# EAGLE schematic WAK-Shield-v11 (EAGLE 6.2)
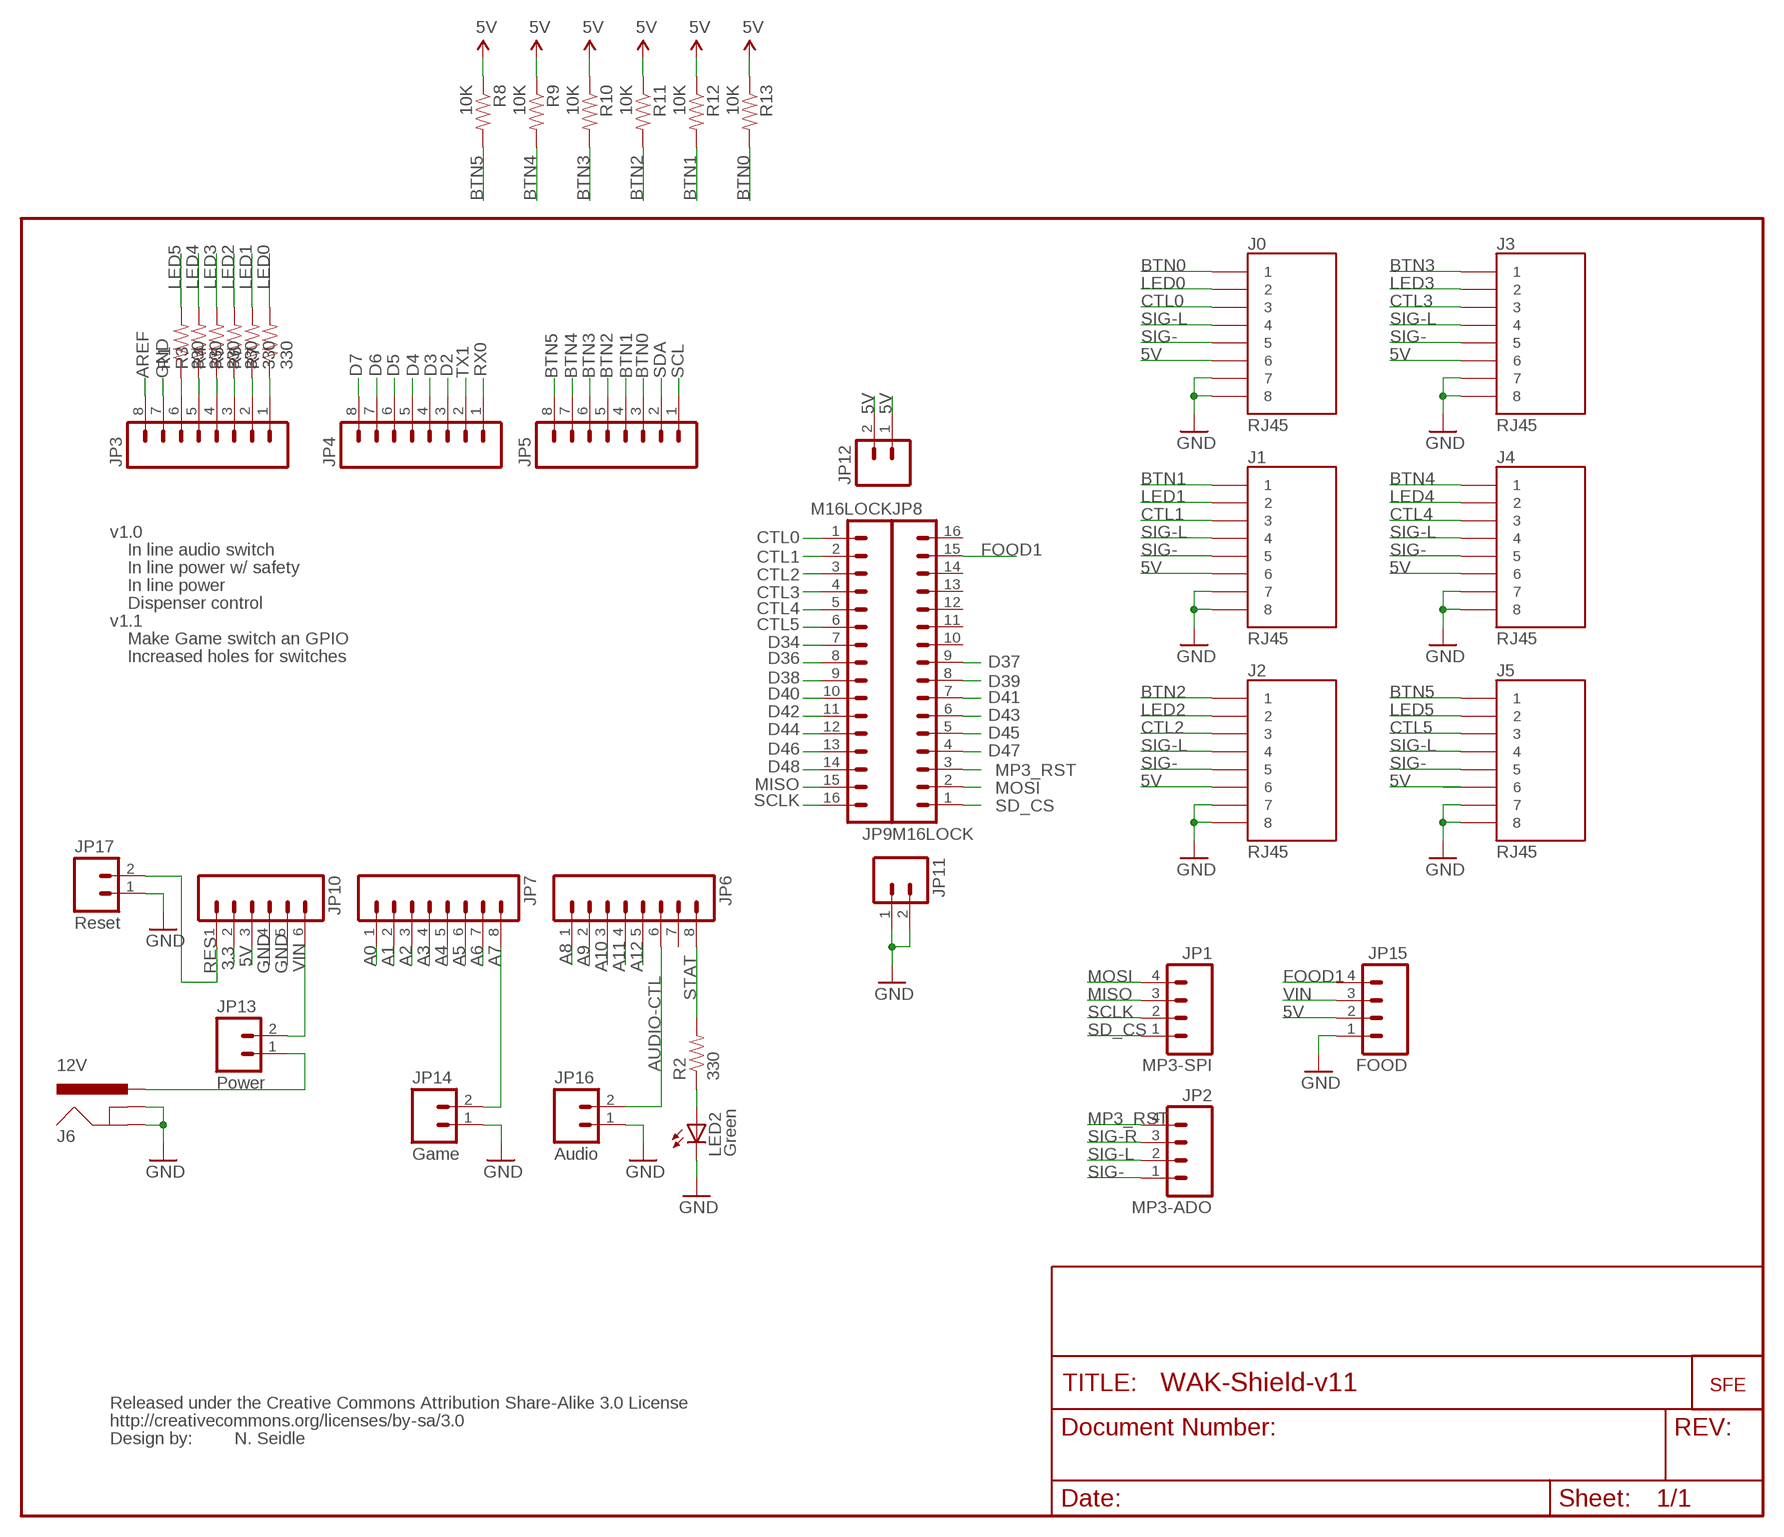
[diagram p0: schematic, sheet 1]

## Parts
J0  RJ45  RJ45-8PTH  [RJ45-8]
J1  RJ45  RJ45-8PTH  [RJ45-8]
J2  RJ45  RJ45-8PTH  [RJ45-8]
J3  RJ45  RJ45-8PTH  [RJ45-8]
J4  RJ45  RJ45-8PTH  [RJ45-8]
J5  RJ45  RJ45-8PTH  [RJ45-8]
J6  12V  POWER_JACKPTH_LOCK  [POWER_JACK_PTH_LOCK]
JP1  MP3-SPI  M04JST-PTH  [JST-4-PTH]
JP2  MP3-ADO  M04JST-PTH  [JST-4-PTH]
JP3  M08LOCK  [1X08_LOCK]
JP4  M08LOCK  [1X08_LOCK]
JP5  M08LOCK  [1X08_LOCK]
JP6  M08LOCK  [1X08_LOCK]
JP7  M08LOCK  [1X08_LOCK]
JP8  M16LOCK  [1X16_LOCK]
JP9  M16LOCK  [1X16_LOCK]
JP10  M06LOCK  [1X06_LOCK]
JP11  M02LOCK  [1X02_LOCK]
JP12  M02LOCK  [1X02_LOCK]
JP13  Power  M02PTH  [1X02]
JP14  Game  M02PTH  [1X02]
JP15  FOOD  M04JST-PTH  [JST-4-PTH]
JP16  Audio  M02PTH  [1X02]
JP17  Reset  M023.5MM  [SCREWTERMINAL-3.5MM-2]
LED2  Green  LED5MM  [LED5MM]
R1  330  RESISTORPTH1  [AXIAL-0.3]
R2  330  RESISTORPTH1  [AXIAL-0.3]
R3  330  RESISTORPTH1  [AXIAL-0.3]
R4  330  RESISTORPTH1  [AXIAL-0.3]
R5  330  RESISTORPTH1  [AXIAL-0.3]
R6  330  RESISTORPTH1  [AXIAL-0.3]
R7  330  RESISTORPTH1  [AXIAL-0.3]
R8  10K  RESISTORPTH1  [AXIAL-0.3]
R9  10K  RESISTORPTH1  [AXIAL-0.3]
R10  10K  RESISTORPTH1  [AXIAL-0.3]
R11  10K  RESISTORPTH1  [AXIAL-0.3]
R12  10K  RESISTORPTH1  [AXIAL-0.3]
R13  10K  RESISTORPTH1  [AXIAL-0.3]
U$1  LOGO-SFENEW  [SFE-NEW-WEBLOGO]
U$2  CREATIVE_COMMONS  [CREATIVE_COMMONS]

## Nets
3.3: JP10.2
5V: J0.6 J1.6 J2.6 J3.6 J4.6 J5.6 JP10.3 JP12.1 JP12.2 JP15.2 R8.P$1 R9.P$1 R10.P$1 R11.P$1 R12.P$1 R13.P$1
A0: JP7.1
A1: JP7.2
A2: JP7.3
A3: JP7.4
A4: JP7.5
A5: JP7.6
A6: JP7.7
A7: JP7.8 JP14.2
A8: JP6.1
A9: JP6.2
A10: JP6.3
A11: JP6.4
A12: JP6.5
AREF: JP3.8
AUDIO-CTL: JP6.6 JP16.2
BTN0: J0.1 JP5.3 R13.P$2
BTN1: J1.1 JP5.4 R12.P$2
BTN2: J2.1 JP5.5 R11.P$2
BTN3: J3.1 JP5.6 R10.P$2
BTN4: J4.1 JP5.7 R9.P$2
BTN5: J5.1 JP5.8 R8.P$2
CTL0: J0.3 JP9.1
CTL1: J1.3 JP9.2
CTL2: J2.3 JP9.3
CTL3: J3.3 JP9.4
CTL4: J4.3 JP9.5
CTL5: J5.3 JP9.6
D2: JP4.3
D3: JP4.4
D4: JP4.5
D5: JP4.6
D6: JP4.7
D7: JP4.8
D34: JP9.7
D36: JP9.8
D37: JP8.9
D38: JP9.9
D39: JP8.8
D40: JP9.10
D41: JP8.7
D42: JP9.11
D43: JP8.6
D44: JP9.12
D45: JP8.5
D46: JP9.13
D47: JP8.4
D48: JP9.14
FOOD1: JP8.15 JP15.4
GND: J0.7 J0.8 J1.7 J1.8 J2.7 J2.8 J3.7 J3.8 J4.7 J4.8 J5.7 J5.8 J6.GND J6.GNDBREAK JP3.7 JP10.4 JP10.5 JP11.1 JP11.2 JP14.1 JP15.1 JP16.1 JP17.1 LED2.K(C)
LED0: J0.2 R7.P$2
LED1: J1.2 R6.P$2
LED2: J2.2 R5.P$2
LED3: J3.2 R4.P$2
LED4: J4.2 R3.P$2
LED5: J5.2 R1.P$2
MISO: JP1.3 JP9.15
MOSI: JP1.4 JP8.2
MP3_RST: JP2.4 JP8.3
N$1: JP3.6 R1.P$1
N$2: JP3.5 R3.P$1
N$3: JP3.4 R4.P$1
N$4: JP3.3 R5.P$1
N$5: JP3.2 R6.P$1
N$6: JP3.1 R7.P$1
N$7: J6.PWR JP13.1
N$127: LED2.A R2.P$1
RES: JP10.1 JP17.2
RX0: JP4.1
SCL: JP5.1
SCLK: JP1.2 JP9.16
SD_CS: JP1.1 JP8.1
SDA: JP5.2
SIG-: J0.5 J1.5 J2.5 J3.5 J4.5 J5.5 JP2.1
SIG-L: J0.4 J1.4 J2.4 J3.4 J4.4 J5.4 JP2.2
SIG-R: JP2.3
STAT: JP6.8 R2.P$2
TX1: JP4.2
VIN: JP10.6 JP13.2 JP15.3
Unconnected: JP6.7 JP8.10 JP8.11 JP8.12 JP8.13 JP8.14 JP8.16

## Notes on the sheet
- v1.0
- In line audio switch
- In line power w/ safety
- In line power
- Dispenser control
- v1.1
- Make Game switch an GPIO
- Increased holes for switches
- N. Seidle

## Library data of the parts
J0 J1-J5 = SparkFun-Connectors:RJ45-8: RJ45 Jack Simple RJ45, 8-pin connection - connector for common Cat5, Cat5e, and Cat6 Ethernet cables. Footprint not yet proven in production. Connector sku is PRT-00643; Breakout PCB sku is BOB-00716.
J6 = SparkFun-Connectors:POWER_JACK: Power Jack This is the standard 5.5mm barrel jack for power. The PTH is the most common, proven, reliable, footprint. All others are experimental. The Slot footprint only works if the mill layer is transmitted to the PCB fab house so be warned. Spark Fun Electronics SKU : PRT-00119. Mating wall wart : TOL-00298 (and others)
JP1 JP2 JP15 = SparkFun-Connectors:M04: Header 4 Standard 4-pin 0.1" header. Use with straight break away headers (SKU : PRT-00116), right angle break away headers (PRT-00553), swiss pins (PRT-00743), machine pins (PRT-00117), and female headers (PRT-00115). Molex polarized connector foot print use with SKU : PRT-08231 with associated crimp pins and housings. 1MM SMD Version SKU: PRT-10208
JP3-JP7 = SparkFun:M08: Header 8 Standard 8-pin 0.1" header. Use with straight break away headers (SKU : PRT-00116), right angle break away headers (PRT-00553), swiss pins (PRT-00743), machine pins (PRT-00117), and female headers (PRT-00115).
JP8 JP9 = SparkFun:M16
JP10 = SparkFun:M06: Header 6 Standard 6-pin 0.1" header. Use with straight break away headers (SKU : PRT-00116), right angle break away headers (PRT-00553), swiss pins (PRT-00743), machine pins (PRT-00117), and female headers (PRT-00115). Molex polarized connector foot print use with SKU : PRT-08094 with associated crimp pins and housings. NOTES ON THE VARIANTS LOCK and LOCK_LONGPADS... This footprint was designed to help hold the alignment of a through-hole component (i.e. 6-pin header) while soldering it into place. You may notice that each hole has been shifted either up or down by 0.005 of an inch from it's more standard position (which is a perfectly straight line). This slight alteration caused the pins (the squares in the middle) to touch the edges of the holes. Because they are alternating, it causes a "brace" to hold the component in place. 0.005 has proven to be the perfect amount of "off-center" position when using our standard breakaway headers. Although looks a little odd when you look at the bare footprint, once you have a header in there, the alteration is very hard to notice. Also, if you push a header all the way into place, it is covered up entirely on the bottom side. This idea of altering the position of holes to aid alignment will be further integrated into the Sparkfun Library for other footprints. It can help hold any component with 3 or more connection pins.
JP11 JP12 = SparkFun:M02: Header 2 Standard 2-pin 0.1" header. Use with straight break away headers (SKU : PRT-00116), right angle break away headers (PRT-00553), swiss pins (PRT-00743), machine pins (PRT-00117), and female headers (PRT-00115). Molex polarized connector foot print use with SKU : PRT-08233 with associated crimp pins and housings.
JP13 JP14 JP16 JP17 = SparkFun-Connectors:M02: Header 2 Standard 2-pin 0.1" header. Use with straight break away headers (SKU : PRT-00116), right angle break away headers (PRT-00553), swiss pins (PRT-00743), machine pins (PRT-00117), and female headers (PRT-00115). Molex polarized connector foot print use with SKU : PRT-08233 with associated crimp pins and housings.
LED2 = SparkFun:LED: LEDs Standard schematic elements and footprints for 5mm, 3mm, 1206, and 0603 sized LEDs. 5mm - Spark Fun Electronics SKU : COM-00529 (and others)
R1-R13 = SparkFun:RESISTOR: Resistor Basic schematic elements and footprints for 0603, 1206, and PTH 1/10th watt (small) resistors.
U$1 = SparkFun:LOGO-SFE: Spark Fun Electronics PCB Logo This is the standard Spark Fun Electronics PCB logo.
U$2 = SparkFun:CREATIVE_COMMONS